# Altium schematic sheet Out_Next_Channel.SchDoc
size A4
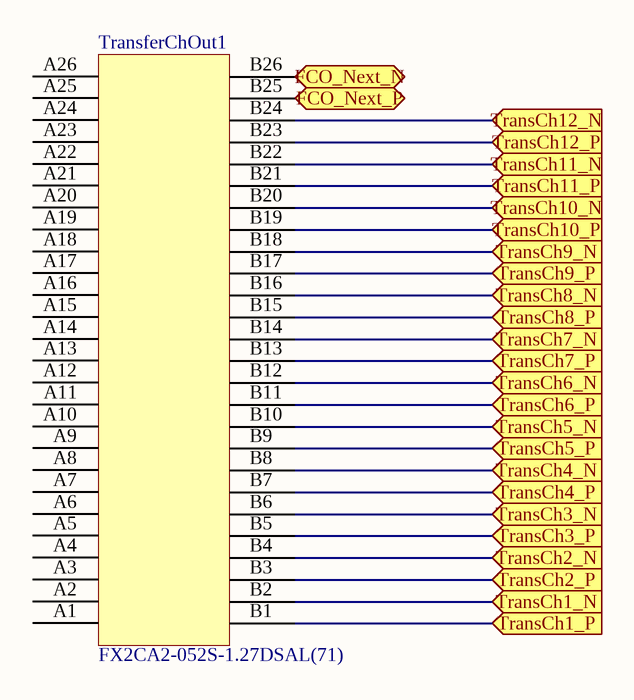
[diagram p0: Out_Next_Channel.SchDoc]

## Parts
TransferChOut1  FX2CA2-052S-1.27DSAL(71)  [FX2CA2-052S-1.27DSAL(71)]

## Ports
FCO_Next_N (in), FCO_Next_P (in), TransCh1_N (in), TransCh1_P (in), TransCh2_N (in), TransCh2_P (in), TransCh3_N (in), TransCh3_P (in), TransCh4_N (in), TransCh4_P (in), TransCh5_N (in), TransCh5_P (in), TransCh6_N (in), TransCh6_P (in), TransCh7_N (in), TransCh7_P (in), TransCh8_N (in), TransCh8_P (in), TransCh9_N (in), TransCh9_P (in), TransCh10_N (in), TransCh10_P (in), TransCh11_N (in), TransCh11_P (in), TransCh12_N (in), TransCh12_P (in)

## Nets
FCO_Next_N: TransferChOut1.B26 ; port FCO_Next_N
FCO_Next_P: TransferChOut1.B25 ; port FCO_Next_P
TransCh1_N: TransferChOut1.B2 ; port TransCh1_N
TransCh1_P: TransferChOut1.B1 ; port TransCh1_P
TransCh2_N: TransferChOut1.B4 ; port TransCh2_N
TransCh2_P: TransferChOut1.B3 ; port TransCh2_P
TransCh3_N: TransferChOut1.B6 ; port TransCh3_N
TransCh3_P: TransferChOut1.B5 ; port TransCh3_P
TransCh4_N: TransferChOut1.B8 ; port TransCh4_N
TransCh4_P: TransferChOut1.B7 ; port TransCh4_P
TransCh5_N: TransferChOut1.B10 ; port TransCh5_N
TransCh5_P: TransferChOut1.B9 ; port TransCh5_P
TransCh6_N: TransferChOut1.B12 ; port TransCh6_N
TransCh6_P: TransferChOut1.B11 ; port TransCh6_P
TransCh7_N: TransferChOut1.B14 ; port TransCh7_N
TransCh7_P: TransferChOut1.B13 ; port TransCh7_P
TransCh8_N: TransferChOut1.B16 ; port TransCh8_N
TransCh8_P: TransferChOut1.B15 ; port TransCh8_P
TransCh9_N: TransferChOut1.B18 ; port TransCh9_N
TransCh9_P: TransferChOut1.B17 ; port TransCh9_P
TransCh10_N: TransferChOut1.B20 ; port TransCh10_N
TransCh10_P: TransferChOut1.B19 ; port TransCh10_P
TransCh11_N: TransferChOut1.B22 ; port TransCh11_N
TransCh11_P: TransferChOut1.B21 ; port TransCh11_P
TransCh12_N: TransferChOut1.B24 ; port TransCh12_N
TransCh12_P: TransferChOut1.B23 ; port TransCh12_P

Not connected (* = marked no-connect by the designer): TransferChOut1 A1(1) A2(2) A3(3) A4(4) A5(5) A6(6) A7(7) A8(8) A9(9) A10(10) A11(11) A12(12) A13(13) A14(14) A15(15) A16(16) A17(17) A18(18) A19(19) A20(20) A21 A22 A23 A24 A25 A26